# EAGLE design Board Layout (EAGLE 6.1)
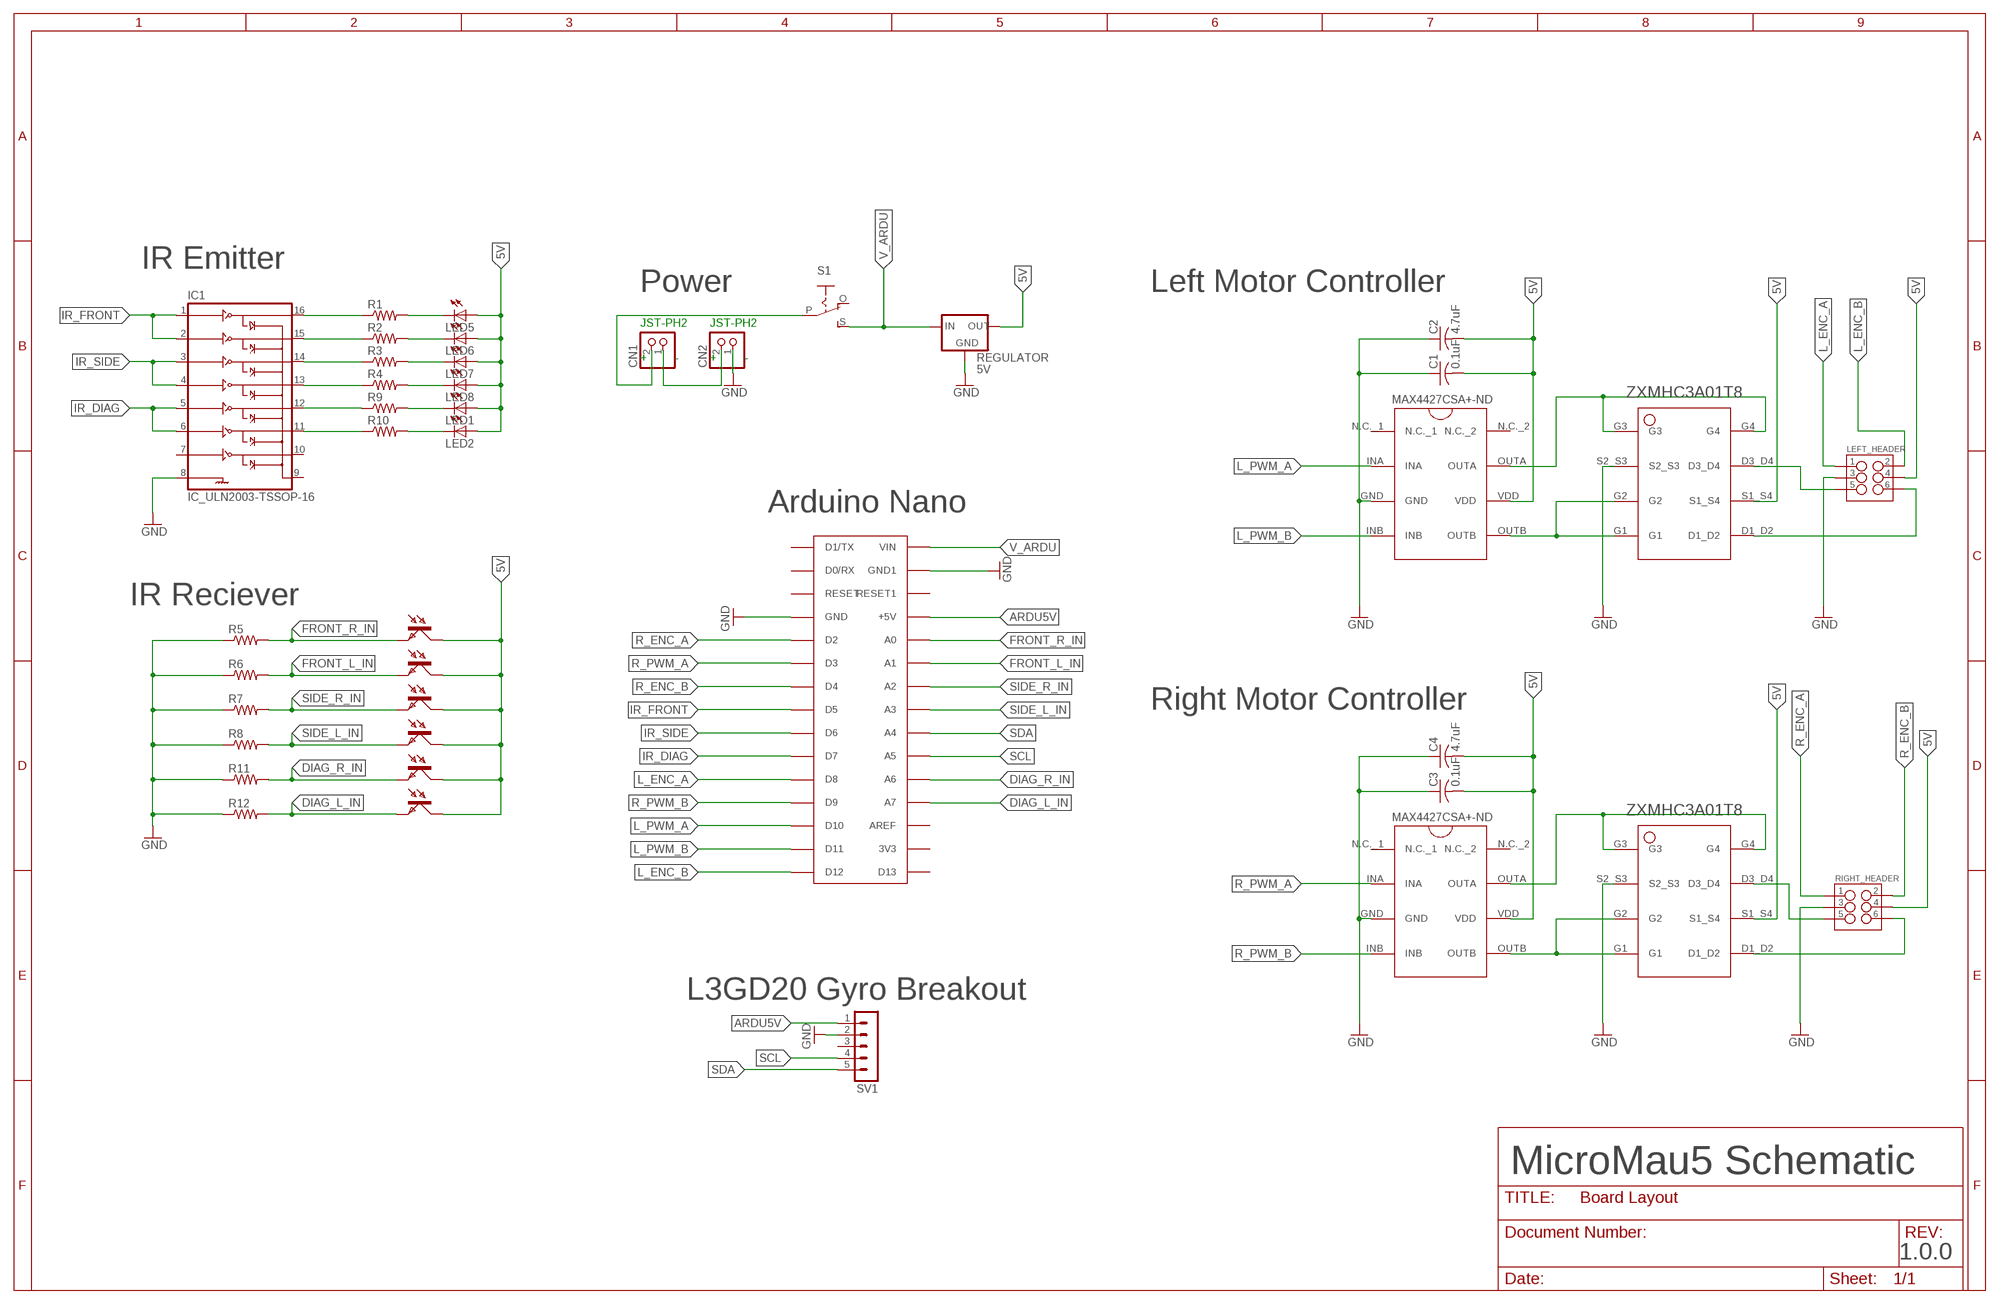
[diagram p0: schematic, sheet 1]

## Parts
C1  0.1uF  C-USC0805  [C0805]
C2  4.7uF  C-USC0805  [C0805]
C3  0.1uF  C-USC0805  [C0805]
C4  4.7uF  C-USC0805  [C0805]
CN1  JST_2PIN-THM  [JST-PH-2-THM]
CN2  JST_2PIN-THM  [JST-PH-2-THM]
IC1  IC_ULN2003-TSSOP-16  [TSSOP-16]
LED1  LED5MM  [LED5MM]
LED2  LED5MM  [LED5MM]
LED5  LED5MM  [LED5MM]
LED6  LED5MM  [LED5MM]
LED7  LED5MM  [LED5MM]
LED8  LED5MM  [LED5MM]
LEFT_HEADER  M03X2SHROUD  [2X3-SHROUDED]
R1  R-US_M0805  [M0805]
R2  R-US_M0805  [M0805]
R3  R-US_M0805  [M0805]
R4  R-US_M0805  [M0805]
R5  R-US_R0805  [R0805]
R6  R-US_R0805  [R0805]
R7  R-US_R0805  [R0805]
R8  R-US_R0805  [R0805]
R9  R-US_M0805  [M0805]
R10  R-US_M0805  [M0805]
R11  R-US_R0805  [R0805]
R12  R-US_R0805  [R0805]
REGULATOR  5V  MCP1700INLINE  [TO92-INLINE]
RIGHT_HEADER  M03X2SHROUD  [2X3-SHROUDED]
S1  EG1218S  [EG1218]
SV1  MA05-1  [MA05-1]
T1  BPX81  [BPX81]
T2  BPX81  [BPX81]
T3  BPX81  [BPX81]
T4  BPX81  [BPX81]
T5  BPX81  [BPX81]
T6  BPX81  [BPX81]
U$1  MAX4427CSA+-ND  [MAX4427CSA+-ND]
U$2  ZXMHC3A01T8  [ZXMHC3A01T8]
U$3  ARDUINONANO  [PDIP-32]
U$4  MAX4427CSA+-ND  [MAX4427CSA+-ND]
U$5  ZXMHC3A01T8  [ZXMHC3A01T8]

## Nets
5V [PWR]: C1.2 C2.2 C3.2 C4.2 LED1.A LED2.A LED5.A LED6.A LED7.A LED8.A LEFT_HEADER.4 REGULATOR.3(OUT) RIGHT_HEADER.4 T1.C T2.C T3.C T4.C T5.C T6.C U$1.VDD U$2.S1_S4 U$4.VDD U$5.S1_S4
ARDU5V: SV1.1 U$3.+5V
DIAG_L_IN: R12.2 T6.E U$3.A7
DIAG_R_IN: R11.2 T5.E U$3.A6
FRONT_L_IN: R6.2 T3.E U$3.A1
FRONT_R_IN: R5.2 T2.E U$3.A0
GND [PWR]: C1.1 C2.1 C3.1 C4.1 CN2.1 IC1.8(GND) LEFT_HEADER.3 R5.1 R6.1 R7.1 R8.1 R11.1 R12.1 REGULATOR.1(GND) RIGHT_HEADER.3 SV1.2 U$1.GND U$2.S2_S3 U$3.GND U$3.GND1 U$4.GND U$5.S2_S3
IR_DIAG: IC1.5(5B) IC1.6(6B) U$3.D7
IR_FRONT: IC1.1(1B) IC1.2(2B) U$3.D5
IR_SIDE: IC1.3(3B) IC1.4(4B) U$3.D6
L_ENC_A: LEFT_HEADER.1 U$3.D8
L_ENC_B: LEFT_HEADER.2 U$3.D12
L_PWM_A: U$1.INA U$3.D10
L_PWM_B: U$1.INB U$3.D11
N$1: U$1.OUTB U$2.G1 U$2.G2
N$2: LEFT_HEADER.5 U$2.D3_D4
N$3: U$1.OUTA U$2.G3 U$2.G4
N$4: LEFT_HEADER.6 U$2.D1_D2
N$5 [PWR]: CN1.1 CN2.2
N$6 [PWR]: CN1.2 S1.P
N$7: U$4.OUTB U$5.G1 U$5.G2
N$8: U$4.OUTA U$5.G3 U$5.G4
N$9: RIGHT_HEADER.5 U$5.D3_D4
N$10: RIGHT_HEADER.6 U$5.D1_D2
N$11: IC1.16(1C) R1.1
N$12: IC1.15(2C) R2.1
N$13: IC1.14(3C) R3.1
N$14: IC1.13(4C) R4.1
N$15: LED5.K(C) R1.2
N$16: LED6.K(C) R2.2
N$17: LED7.K(C) R3.2
N$18: LED8.K(C) R4.2
N$19: IC1.12(5C) R9.1
N$20: IC1.11(6C) R10.1
N$21: LED1.K(C) R9.2
N$22: LED2.K(C) R10.2
R_ENC_A: RIGHT_HEADER.1 U$3.D2
R_ENC_B: RIGHT_HEADER.2 U$3.D4
R_PWM_A: U$3.D3 U$4.INA
R_PWM_B: U$3.D9 U$4.INB
SCL: SV1.4 U$3.A5
SDA: SV1.5 U$3.A4
SIDE_L_IN: R8.2 T4.E U$3.A3
SIDE_R_IN: R7.2 T1.E U$3.A2
V_ARDU [PWR]: REGULATOR.2(IN) S1.S U$3.VIN
Unconnected: IC1.7(7B) IC1.9(COM) IC1.10(7C) S1.O SV1.3 U$1.N.C._1 U$1.N.C._2 U$3.3V3 U$3.AREF U$3.D0/RX U$3.D1/TX U$3.D13 U$3.RESET U$3.RESET1 U$4.N.C._1 U$4.N.C._2

## Notes on the sheet
- IR Emitter
- Power | Left Motor Controller
- JST-PH2 | JST-PH2
- + | - | + | -
- Arduino Nano
- IR Reciever
- Right Motor Controller
- L3GD20 Gyro Breakout
- MicroMau5 Schematic
- 1.0.0

## Library data of the parts
C1-C4 = adafruit:C-US: CAPACITOR, American symbol
CN1 CN2 = adafruit:JST_2PIN: JST 2-Pin Connectors of various flavors SMT-RA (S2B-PH-SM4) 4UConnector #17311 SMT (B2B-PH-SM4) THM-RA (S2B-PH) THM (B2B-PH)
IC1 = dp_devices:IC_ULN2003: 7 Darlington Array Driver
LED1 LED2 LED5-LED8 = adafruit:LED: LED OSRAM: - CHIPLED LG R971, LG N971, LY N971, LG Q971, LY Q971, LO R971, LY R971 LH N974, LH R974 LS Q976, LO Q976, LY Q976 LO Q996 - Hyper CHIPLED LW Q18S LB Q993, LB Q99A, LB R99A - SideLED LS A670, LO A670, LY A670, LG A670, LP A670 LB A673, LV A673, LT A673, LW A673 LH A674 LY A675 LS A676, LA A676, LO A676, LY A676, LW A676 LS A679, LY A679, LG A679 - Hyper Micro SIDELED® LS Y876, LA Y876, LO Y876, LY Y876 LT Y87S - SmartLED LW L88C, LW L88S LB L89C, LB L89S, LG L890 LS L89K, LO L89K, LY L89K LS L896, LA L896, LO L896, LY L896 - TOPLED LS T670, LO T670, LY T670, LG T670, LP T670 LSG T670, LSP T670, LSY T670, LOP T670, LYG T670 LG T671, LOG T671, LSG T671 LB T673, LV T673, LT T673, LW T673 LH T674 LS T676, LA T676, LO T676, LY T676, LB T676, LH T676, LSB T676, LW T676 LB T67C, LV T67C, LT T67C, LS T67K, LO T67K, LY T67K, LW E67C LS E67B, LA E67B, LO E67B, LY E67B, LB E67C, LV E67C, LT E67C LW T67C LS T679, LY T679, LG T679 LS T770, LO T770, LY T770, LG T770, LP T770 LB T773, LV T773, LT T773, LW T773 LH T774 LS E675, LA E675, LY E675, LS T675 LS T776, LA T776, LO T776, LY T776, LB T776 LHGB T686 LT T68C, LB T68C - Hyper Mini TOPLED® LB M676 - Mini TOPLED Santana® LG M470 LS M47K, LO M47K, LY M47K Source: http://www.osram.convergy.de/
LEFT_HEADER RIGHT_HEADER = SparkFun-Connectors:M03X2: 2x3 .1" header. Shrouded, with keying- CONN-10681 SMT- CONN-11415 Pogo pins- HW-11044; PROD_ID: CONN-10681
R1-R12 = adafruit:R-US_: RESISTOR, American symbol
REGULATOR = adafruit:MCP1700: VOLTAGE REGULATOR
S1 = adafruit:EG1218: SLIDING SWITCH 0.1" spacing through hole, vertical SPDT slide switch http://www.ladyada.net/library/pcb/eaglelibrary.html
SV1 = con-lstb:MA05-1: PIN HEADER; OC_FARNELL: unknown; OC_NEWARK: unknown
T1-T6 = opto-trans-siemens:BPX81: PHOTO TRANSISTOR; OC_FARNELL: unknown; OC_NEWARK: unknown
U$1 U$4 = MAX4427CSA+-ND:MAX4427CSA+-ND
U$2 U$5 = ZXMHC3A01T8:ZXMHC3A01T8
U$3 = jet-lib:ARDUINONANO

## Net classes
0 default: width 0.254 mm, drill 0.508 mm, clearance 0.203 mm
1 PWR: width 0.508 mm, drill 0.508 mm, clearance 0.203 mm

## Board
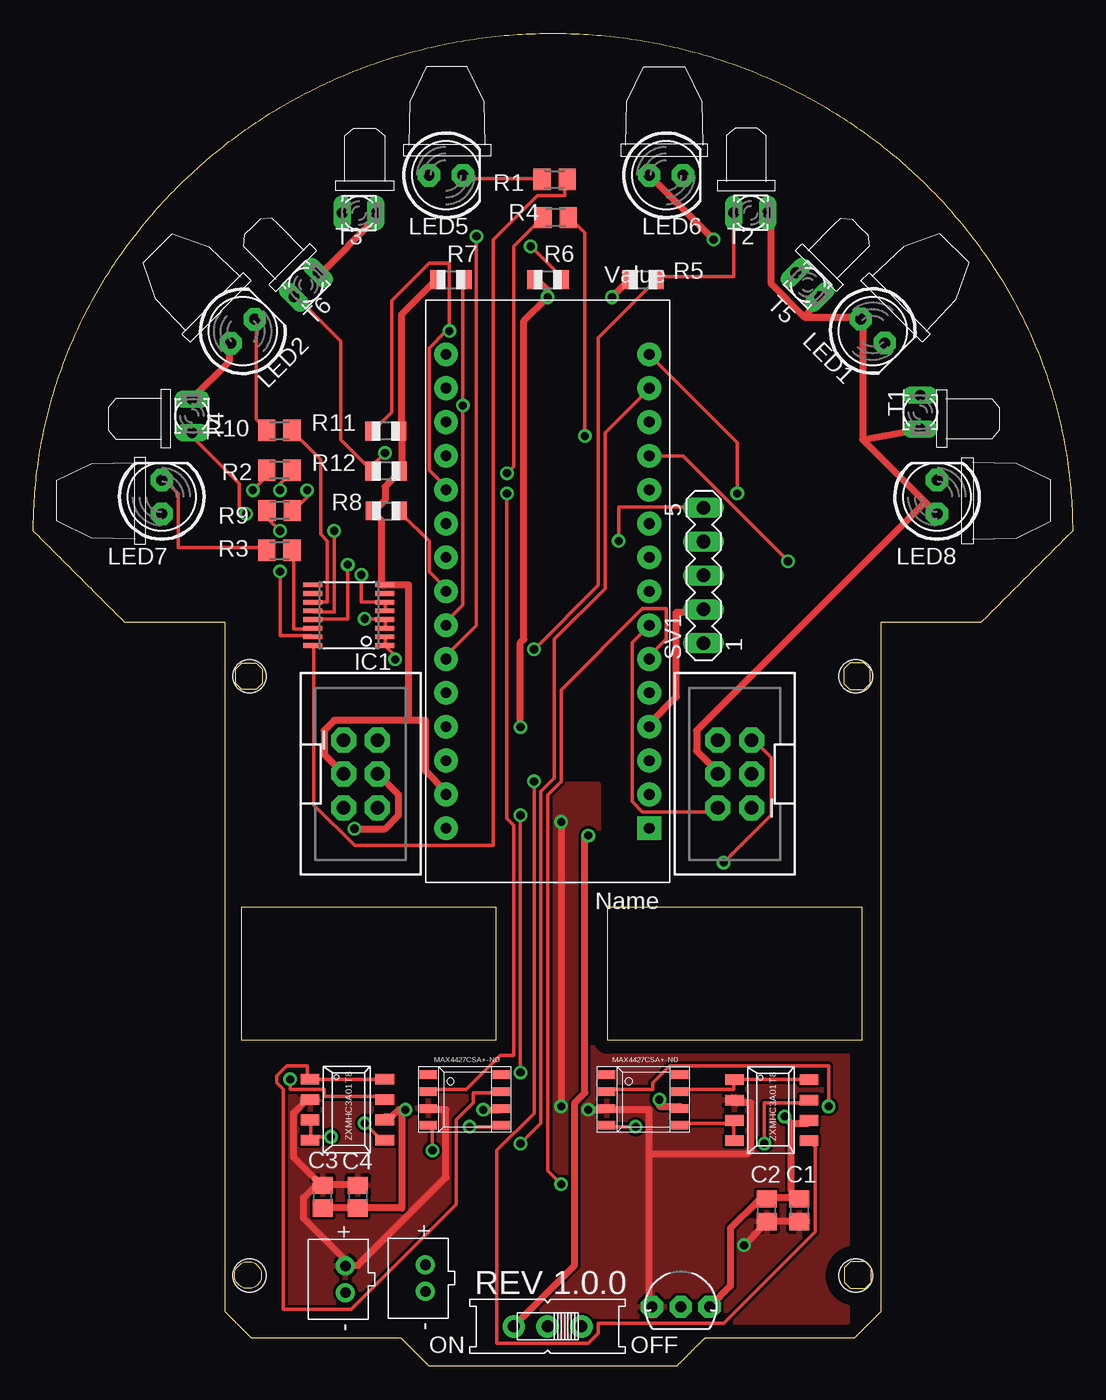
[diagram p1: board, top side]
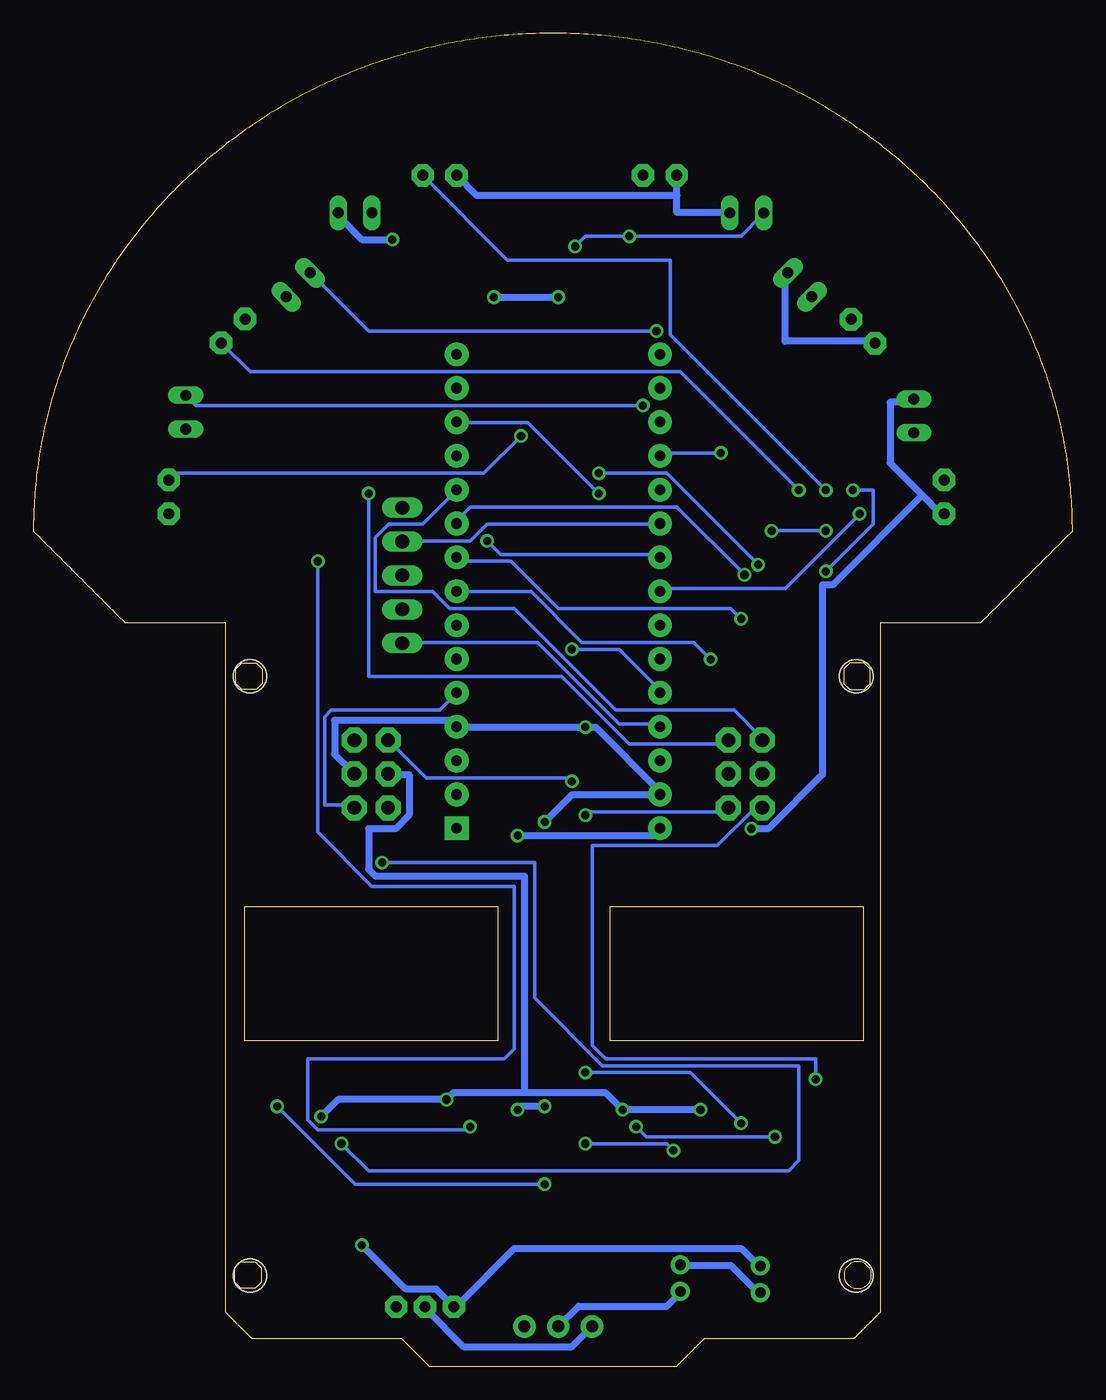
[diagram p2: board, bottom side, seen from below]

Size 77.93 x 99.99 mm. Coordinates in mm from the lower left corner, seen from the top.
Outline: 38.99,99.99 38.65,99.99 38.31,99.99 37.98,99.98 37.65,99.97 37.31,99.96 36.98,99.94 36.65,99.93 36.32,99.91 35.99,99.88 35.66,99.86 35.33,99.83 35,99.8 34.67,99.77 34.35,99.73 34.02,99.69 33.7,99.65 33.37,99.61 33.05,99.56 32.73,99.51 32.41,99.46 32.08,99.41 31.76,99.35 31.45,99.3 31.13,99.23 30.81,99.17 30.5,99.11 30.18,99.04 29.87,98.97 29.55,98.89 29.24,98.82 28.93,98.74 28.62,98.66 28.31,98.58 28,98.49 27.7,98.4 27.39,98.31 27.09,98.22 26.78,98.13 26.18,97.93 25.88,97.83 25.58,97.73 25.28,97.62 24.99,97.51 24.69,97.4 24.4,97.29 24.1,97.18 23.81,97.06 23.52,96.94 23.23,96.82 22.94,96.69 22.65,96.57 22.37,96.44 22.08,96.31 21.8,96.18 21.52,96.04 21.24,95.91 20.96,95.77 20.68,95.63 20.4,95.49 20.13,95.34 19.85,95.19 19.31,94.9 19.04,94.74 18.77,94.59 18.5,94.43 18.24,94.27 17.97,94.11 17.71,93.95 17.45,93.78 17.19,93.62 16.93,93.45 16.67,93.28 16.42,93.1 16.16,92.93 15.91,92.75 15.66,92.57 15.41,92.4 15.16,92.21 14.92,92.03 14.67,91.84 14.43,91.66 14.19,91.47 13.95,91.28 13.71,91.08 13.47,90.89 13.24,90.69 13,90.49 12.77,90.29 12.54,90.09 12.31,89.89 12.09,89.68 11.86,89.48 11.64,89.27 11.42,89.06 11.2,88.84 10.98,88.63 10.77,88.42 10.55,88.2 10.34,87.98 9.92,87.54 9.71,87.32 9.51,87.09 9.3,86.86 9.1,86.64 8.9,86.4 8.7,86.17 8.51,85.94 8.32,85.71 8.12,85.47 7.93,85.23 7.56,84.75 7.37,84.51 7.19,84.27 7.01,84.02 6.83,83.78 6.66,83.53 6.48,83.28 6.31,83.03 6.14,82.78 5.97,82.53 5.81,82.27 5.64,82.02 5.48,81.76 5.32,81.5 5.17,81.24 5.01,80.98 4.86,80.72 4.71,80.45 4.56,80.19 4.41,79.92 4.27,79.65 4.12,79.38 3.98,79.11 3.84,78.84 3.71,78.57 3.57,78.3 3.44,78.02 3.31,77.75 3.19,77.47 3.06,77.19 2.94,76.91 2.82,76.63 2.7,76.35 2.59,76.06 2.48,75.78 2.37,75.49 2.26,75.21 2.15,74.92 2.05,74.63 1.95,74.34 1.85,74.05 1.75,73.76 1.66,73.47 1.57,73.17 1.48,72.88 1.39,72.58 1.31,72.28 1.23,71.99 1.15,71.69 1.07,71.39 1,71.09 0.93,70.79 0.86,70.48 0.79,70.18 0.73,69.88 0.67,69.57 0.61,69.26 0.55,68.96 0.5,68.65 0.45,68.34 0.4,68.03 0.35,67.72 0.31,67.41 0.27,67.1 0.23,66.79 0.2,66.47 0.17,66.16 0.14,65.84 0.11,65.53 0.09,65.21 0.07,64.89 0.05,64.58 0.03,64.26 0.02,63.94 0.01,63.62 0,63.3 0,62.98 0,62.65 0.11,62.55 0.22,62.44 0.32,62.33 0.43,62.23 0.54,62.12 0.75,61.9 0.86,61.8 0.97,61.69 1.07,61.58 1.18,61.47 1.29,61.37 1.4,61.26 1.5,61.15 1.61,61.04 1.72,60.94 1.83,60.83 1.93,60.72 2.04,60.62 2.15,60.51 2.25,60.4 2.36,60.29 2.47,60.19 2.68,59.97 2.79,59.86 2.9,59.76 3.01,59.65 3.11,59.54 3.22,59.43 3.33,59.33 3.54,59.11 3.65,59 3.76,58.9 3.97,58.68 4.08,58.58 4.19,58.47 4.29,58.36 4.4,58.25 4.51,58.15 4.62,58.04 4.72,57.93 4.83,57.82 4.94,57.72 5.05,57.61 5.26,57.39 5.37,57.29 5.48,57.18 5.69,56.97 5.8,56.86 5.9,56.75 6.01,56.64 6.12,56.54 6.23,56.43 6.33,56.32 6.66,56 6.76,55.89 6.87,55.78 14.39,55.78 14.39,4.08 14.42,4.05 14.45,4.02 14.51,3.95 14.54,3.92 14.58,3.89 14.61,3.86 14.67,3.8 14.7,3.77 14.73,3.73 14.79,3.67 14.83,3.64 14.86,3.61 14.89,3.58 14.92,3.55 14.95,3.52 15.04,3.42 15.07,3.39 15.11,3.36 15.17,3.3 15.2,3.27 15.23,3.24 15.32,3.14 15.35,3.11 15.42,3.05 15.45,3.02 15.54,2.93 15.57,2.89 15.6,2.86 15.67,2.8 15.7,2.77 15.73,2.74 15.76,2.71 15.79,2.68 15.82,2.65 15.85,2.61 15.88,2.58 15.91,2.55 15.95,2.52 15.98,2.49 16.01,2.46 16.07,2.4 16.1,2.37 16.13,2.33 16.16,2.3 16.19,2.27 16.29,2.18 16.32,2.15 16.35,2.12 16.38,2.09 27.6,2.09 27.63,2.05 27.67,2.02 27.7,1.99 27.73,1.96 27.76,1.92 27.8,1.89 27.83,1.86 27.86,1.82 27.89,1.79 27.93,1.76 27.96,1.73 27.99,1.69 28.02,1.66 28.06,1.63 28.09,1.6 28.15,1.53 28.19,1.5 28.22,1.47 28.28,1.4 28.32,1.37 28.35,1.34 28.38,1.3 28.42,1.27 28.45,1.24 28.48,1.21 28.51,1.17 28.58,1.11 28.61,1.08 28.64,1.04 28.68,1.01 28.71,0.98 28.74,0.94 28.77,0.91 28.81,0.88 28.87,0.81 28.9,0.78 28.94,0.75 28.97,0.72 29,0.68 29.07,0.62 29.1,0.59 29.13,0.55 29.16,0.52 29.2,0.49 29.23,0.46 29.26,0.42 29.29,0.39 29.33,0.36 29.36,0.33 29.39,0.29 29.43,0.26 29.46,0.23 29.49,0.2 29.52,0.16 29.56,0.13 29.59,0.1 29.62,0.07 29.65,0.03 29.69,0 48.25,0 48.28,0.03 48.31,0.07 48.34,0.1 48.38,0.13 48.41,0.16 48.44,0.2 48.47,0.23 48.51,0.26 48.54,0.29 48.61,0.36 48.67,0.42 48.7,0.46 48.74,0.49 48.8,0.55 48.83,0.59 48.87,0.62 48.93,0.68 49,0.75 49.06,0.81 49.09,0.85 49.13,0.88 49.16,0.91 49.19,0.94 49.22,0.98 49.26,1.01 49.32,1.08 49.35,1.11 49.39,1.14 49.42,1.17 49.45,1.21 49.49,1.24 49.52,1.27 49.58,1.34 49.65,1.4 49.71,1.47 49.75,1.5 49.78,1.53 49.84,1.6 49.88,1.63 49.91,1.66 49.94,1.69 50.01,1.76 50.04,1.79 50.1,1.86 50.14,1.89 50.17,1.92 50.2,1.96 50.23,1.99 50.27,2.02 50.3,2.05 50.33,2.09 61.55,2.09 61.58,2.12 61.61,2.15 61.64,2.18 61.74,2.27 61.77,2.3 61.83,2.37 61.86,2.4 61.96,2.49 61.99,2.52 62.02,2.55 62.05,2.58 62.08,2.61 62.11,2.65 62.14,2.68 62.17,2.71 62.2,2.74 62.24,2.77 62.27,2.8 62.33,2.86 62.36,2.89 62.39,2.93 62.42,2.96 62.49,3.02 62.52,3.05 62.55,3.08 62.58,3.11 62.61,3.14 62.7,3.24 62.73,3.27 62.77,3.3 62.83,3.36 62.86,3.39 62.89,3.42 62.98,3.52 63.01,3.55 63.05,3.58 63.08,3.61 63.11,3.64 63.14,3.67 63.2,3.73 63.23,3.77 63.26,3.8 63.33,3.86 63.36,3.89 63.39,3.92 63.42,3.95 63.48,4.02 63.51,4.05 63.54,4.08 63.54,55.78 71.06,55.78 71.17,55.89 71.28,56 71.38,56.11 71.49,56.21 71.6,56.32 71.71,56.43 71.81,56.54 72.03,56.75 72.14,56.86 72.24,56.97 72.35,57.07 72.46,57.18 72.56,57.29 72.67,57.39 72.78,57.5 72.89,57.61 72.99,57.72 73.1,57.82 73.21,57.93 73.32,58.04 73.42,58.15 73.53,58.25 73.64,58.36 73.75,58.47 73.96,58.68 74.07,58.79 74.17,58.9 74.28,59 74.39,59.11 74.5,59.22 74.6,59.33 74.71,59.43 74.82,59.54 74.93,59.65 75.03,59.76 75.14,59.86 75.25,59.97 75.36,60.08 75.46,60.19 75.57,60.29 75.68,60.4 75.89,60.62 76,60.72 76.11,60.83 76.32,61.04 76.43,61.15 76.54,61.26 76.64,61.37 76.75,61.47 76.86,61.58 76.97,61.69 77.07,61.8 77.18,61.9 77.29,62.01 77.4,62.12 77.5,62.23 77.61,62.33 77.72,62.44 77.83,62.55 77.93,62.65 77.93,62.98 77.93,63.3 77.92,63.62 77.91,63.94 77.9,64.26 77.88,64.58 77.86,64.89 77.84,65.21 77.82,65.53 77.79,65.84 77.76,66.16 77.73,66.47 77.7,66.79 77.66,67.1 77.62,67.41 77.58,67.72 77.53,68.03 77.48,68.34 77.43,68.65 77.38,68.96 77.32,69.26 77.27,69.57 77.21,69.88 77.14,70.18 77.08,70.48 77.01,70.79 76.93,71.09 76.86,71.39 76.79,71.69 76.71,71.99 76.63,72.28 76.54,72.58 76.45,72.88 76.37,73.17 76.27,73.47 76.18,73.76 76.08,74.05 75.99,74.34 75.88,74.63 75.78,74.92 75.68,75.21 75.46,75.78 75.34,76.06 75.23,76.35 75.11,76.63 74.99,76.91 74.75,77.47 74.62,77.75 74.49,78.02 74.36,78.3 74.23,78.57 74.09,78.84 73.95,79.11 73.81,79.38 73.67,79.65 73.52,79.92 73.38,80.19 73.23,80.45 73.08,80.72 72.92,80.98 72.77,81.24 72.61,81.5 72.45,81.76 72.13,82.27 71.96,82.53 71.79,82.78 71.62,83.03 71.45,83.28 71.27,83.53 71.1,83.78 70.92,84.02 70.56,84.51 70.37,84.75 70.19,84.99 70,85.23 69.81,85.47 69.62,85.71 69.42,85.94 69.23,86.17 69.03,86.4 68.83,86.64 68.63,86.86 68.43,87.09 68.22,87.32 68.01,87.54 67.8,87.76 67.6,87.98 67.38,88.2 67.17,88.42 66.95,88.63 66.73,88.84 66.51,89.06 66.29,89.27 66.07,89.48 65.84,89.68 65.62,89.89 65.39,90.09 65.16,90.29 64.93,90.49 64.7,90.69 64.46,90.89 64.22,91.08 63.99,91.28 63.75,91.47 63.5,91.66 63.26,91.84 63.02,92.03 62.77,92.21 62.52,92.4 62.27,92.57 62.02,92.75 61.77,92.93 61.52,93.1 61.26,93.28 61,93.45 60.74,93.62 60.48,93.78 60.22,93.95 59.96,94.11 59.7,94.27 59.43,94.43 59.16,94.59 58.89,94.74 58.62,94.9 58.08,95.19 57.81,95.34 57.53,95.49 57.25,95.63 56.98,95.77 56.7,95.91 56.41,96.04 56.13,96.18 55.85,96.31 55.56,96.44 55.28,96.57 54.99,96.69 54.7,96.82 54.41,96.94 54.12,97.06 53.83,97.18 53.54,97.29 53.24,97.4 52.95,97.51 52.65,97.62 52.05,97.83 51.75,97.93 51.15,98.13 50.84,98.22 50.54,98.31 50.23,98.4 49.93,98.49 49.62,98.58 49.31,98.66 49,98.74 48.38,98.89 48.07,98.97 47.75,99.04 47.44,99.11 47.12,99.17 46.8,99.23 46.49,99.3 46.17,99.35 45.85,99.41 45.53,99.46 45.21,99.51 44.88,99.56 44.56,99.61 44.24,99.65 43.91,99.69 43.59,99.73 43.26,99.77 42.93,99.8 42.6,99.83 42.28,99.86 41.95,99.88 41.62,99.91 41.29,99.93 40.95,99.94 40.62,99.96 40.29,99.97 39.95,99.98 39.62,99.99 39.28,99.99 38.95,99.99
Outline: 62.12,24.44 43.07,24.44 43.07,34.44 62.12,34.44 62.12,24.44
Outline: 34.69,24.44 15.64,24.44 15.64,34.44 34.69,34.44 34.69,24.44
Outline: 17.16,51.21 16.72,50.76 15.61,50.76 15.16,51.21 15.16,52.31 15.61,52.76 16.72,52.76 17.16,52.31 17.16,51.21
Outline: 17.11,7.1 17.11,6.55 16.99,6.3 16.81,6.12 16.63,5.94 16.38,5.83 15.83,5.83 15.58,5.94 15.4,6.12 15.22,6.3 15.11,6.55 15.11,7.1 15.22,7.35 15.4,7.53 15.58,7.72 15.83,7.83 16.38,7.83 16.63,7.72 16.81,7.53 16.99,7.35 17.11,7.1
Outline: 60.77,51.21 61.22,50.76 62.32,50.76 62.77,51.21 62.77,52.31 62.32,52.76 61.22,52.76 60.77,52.31 60.77,51.21
Outline: 60.83,7.38 60.83,6.27 61.27,5.83 62.38,5.83 62.83,6.27 62.83,7.38 62.38,7.83 61.27,7.83 60.83,7.38
Copper layers (1*16): Top 0.035mm / dielectric 1.5mm / Bottom 0.035mm
Design rules: minimum track width 10mil, minimum drill 24mil, track to track 8mil, track to pad 8mil, pad to pad 8mil, via to via 8mil, smd to smd 8mil, copper to edge 40mil, drill to drill 8mil, minimum pad ring 10mil, minimum via ring 8mil, stop-mask expansion 4mil, vias tented up to drill 0mil, thermal gap 10mil
Holes 2.5 mm at 16.21,6.79 16.21,51.75 61.68,51.75 61.68,6.79

### Footprints (pad centres in the part's own frame; a part is rotated, then mirrored left to right if it is on the bottom)
C0805 = smd 1.3 x 1.5: 1 -0.85,0; 2 0.85,0
JST-PH-2-THM = drill 0.8 pad 1.422: 1 1,0; 2 -1,0
TSSOP-16 = smd 0.35 x 1.43: 1 -2.275,-2.7; 2 -1.625,-2.7; 3 -0.975,-2.7; 4 -0.325,-2.7; 5 0.325,-2.7; 6 0.975,-2.7; 7 1.625,-2.7; 8 2.275,-2.7; 9 2.275,2.7; 10 1.625,2.7; 11 0.975,2.7; 12 0.325,2.7; 13 -0.325,2.7; 14 -0.975,2.7; 15 -1.625,2.7; 16 -2.275,2.7
LED5MM = drill 0.813 pad 1.676 octagon: A -1.27,0; K 1.27,0
2X3-SHROUDED = drill 1.016 pad 1.88 octagon: 1 -1.27,2.54; 2 1.27,2.54; 3 -1.27,0; 4 1.27,0; 5 -1.27,-2.54; 6 1.27,-2.54
M0805 = smd 1.3 x 1.6: 1 -0.95,0; 2 0.95,0
R0805 = smd 1.1 x 1.4: 1 -1,0; 2 1,0
TO92-INLINE = drill 0.813 pad 1.676 octagon: 1 -2.159,0; 2 0,0; 3 2.159,0
EG1218 = drill 0.9 pad 1.676: O -2.54,0; P 0,0; S 2.54,0
MA05-1 = drill 1.016 long: 1 -5.08,0; 2 -2.54,0; 3 0,0; 4 2.54,0; 5 5.08,0
BPX81 = drill 0.813 long: C 1.27,0; E -1.27,0
MAX4427CSA+-ND = smd 1.27 x 0.635: GND -2.946,-0.762; INA -2.946,0.508; INB -2.946,-2.032; N.C._1 -2.946,1.778; N.C._2 2.54,1.778; OUTA 2.54,0.508; OUTB 2.54,-2.032; VDD 2.54,-0.762
ZXMHC3A01T8 = smd 1.4 x 0.8: D1_D2 2.695,-2.22; D3_D4 2.695,0.84; G1 -2.905,-2.22; G2 -2.905,-0.69; G3 -2.905,2.37; G4 2.695,2.37; S1_S4 2.695,-0.69; S2_S3 -2.905,0.84
PDIP-32 = drill 0.8 pad 1.778: 3V3 15.24,-35.56; +5V 15.24,-10.16; A0 15.24,-12.7; A1 15.24,-15.24; A2 15.24,-17.78; A3 15.24,-20.32; A4 15.24,-22.86; A5 15.24,-25.4; A6 15.24,-27.94; A7 15.24,-30.48; AREF 15.24,-33.02; D0/RX 0,-5.08; D2 0,-12.7; D3 0,-15.24; D4 0,-17.78; D5 0,-20.32; D6 0,-22.86; D7 0,-25.4; D8 0,-27.94; D9 0,-30.48; D10 0,-33.02; D11 0,-35.56; D12 0,-38.1; D13 15.24,-38.1; GND 0,-10.16; GND1 15.24,-5.08; RESET 0,-7.62; RESET1 15.24,-7.62; VIN 15.24,-2.54 | drill 0.8 pad 1.778 square: D1/TX 0,-2.54

### Placement (x,y rotation side)
C1  57.45,11.7 90 top
C2  55,11.7 90 top
C3  21.69,12.72 270 top
C4  24.34,12.72 270 top
CN1  29.41,6.6 90 top
CN2  23.41,6.52 90 top
IC1  23.66,56.34 90 top
LED1  62.95,77.66 315 top
LED2  15.71,77.64 45 top
LED5  30.95,89.34 0 top
LED6  47.46,89.34 0 top
LED7  9.63,65.21 90 top
LED8  67.78,65.21 90 top
LEFT_HEADER  24.54,44.43 0 top
R1  39.09,89.03 180 top
R2  18.45,67.2 0 top
R3  18.45,61.2 180 top
R4  39.17,86.16 0 top
R5  45.73,81.52 0 top
R6  38.59,81.52 0 top
R7  31.32,81.52 0 top
R8  26.47,64.16 0 top
R9  18.46,64.19 0 top
R10  18.45,70.2 180 top
R11  26.42,70.16 180 top
R12  26.45,67.15 180 top
REGULATOR  48.56,4.45 0 top
RIGHT_HEADER  52.6,44.43 180 top
S1  38.57,2.98 180 top
SV1  50.27,59.32 90 top
T1  66.51,71.56 270 top
T2  53.81,86.53 0 top
T3  24.43,86.51 0 top
T4  11.9,71.29 90 top
T5  58.07,81.13 315 top
T6  20.45,81.13 45 top
U$1  32.56,20.1 0 top
U$2  23.66,19.17 0 top
U$3  46.19,37.81 180 top
U$4  45.94,20.1 0 top
U$5  55.48,19.13 0 top

### Tracks (layer width: path | path; a pad name or v marks a point on that pad's centre or on a via)
5V  (via drill 0.61)
  Top 0.508: T6.C 21.55,81.98 25.61,86.04 25.61,86.29 T3.C | T4.C 11.9,72.58 14.69,75.37 14.69,76.64 LED2.A | v24.09,40.32 26.37,40.32 27.39,41.34 27.39,42.86 25.87,44.38 LEFT_HEADER.4 | 56.85,18.22 58.12,18.22 U$5.S1_S4 | 56.85,18.22 56.85,13.14 57.36,12.63 C1.2 56.85,12.89 56.85,12.63 55.08,12.63 C2.2 54.82,12.38 54.31,12.38 52.28,10.35 52.28,6.03 50.76,4.51 REGULATOR.3 | C3.2 C4.2 27.64,11.87 27.64,19.24 | v33.74,19.24 35.01,19.24 U$1.VDD | 27.64,19.24 27.39,19.24 26.88,18.73 26.37,18.73 U$2.S1_S4 | v46.95,20 46.95,19.49 48.47,19.49 U$4.VDD | 27.64,19.24 v27.9,19.24 | v56.35,18.73 56.85,18.22 | 57.87,78.67 55.33,81.21 55.33,86.04 55.08,86.29 T2.C | 57.87,78.67 61.93,78.67 LED1.A 62.19,78.42 62.19,69.53 | 62.19,69.53 66.89,64.83 | 66.89,64.83 LED8.A | 66.89,64.83 49.74,47.69 49.74,46.16 51.27,44.64 RIGHT_HEADER.4 | v51.01,84.52 LED6.A | 57.87,78.67 T5.C | 62.19,69.53 T1.C
  Bottom 0.508: 29.68,87.82 29.68,86.55 25.87,86.55 T3.C | 29.68,87.82 LED5.A | LED6.A 44.66,87.82 29.68,87.82 | 11.26,65.34 13.67,67.75 13.67,72.32 11.9,72.32 T4.C | 11.26,65.34 9.86,63.94 LED7.A | v24.09,40.32 22.82,40.32 18.75,44.38 18.75,58.61 17.99,58.61 11.26,65.34 | T6.C 21.55,81.98 21.55,76.9 14.94,76.9 LED2.A | v27.9,19.24 v33.74,19.24 35.01,20.51 41.11,20.51 | 41.11,20.51 46.44,20.51 v46.95,20 55.08,20 v56.35,18.73 | 41.11,20.51 41.11,36.76 52.28,36.76 52.79,37.27 52.79,40.32 50.76,40.32 49.74,41.34 49.74,44.38 51.27,44.38 RIGHT_HEADER.4 | v51.01,84.52 53.3,84.52 55.08,86.29 T2.C
ARDU5V
  Bottom 0.254: SV1.1 50.25,54.29 40.09,54.29 33.99,48.19 30.95,48.19 U$3.+5V
DIAG_L_IN  (via drill 0.61)
  Top 0.254: T6.E 19.77,80.2 23.07,76.9 23.07,69.53 25.36,67.24 R12.2 25.61,67.24 25.61,67.75 v26.37,68.51
  Bottom 0.254: v26.37,68.51 30.95,68.51 U$3.A7
DIAG_R_IN  (via drill 0.61)
  Top 0.254: 30.95,77.66 29.68,76.39 29.68,67.24 30.95,65.97 U$3.A6 | 30.95,77.66 31.2,77.91 31.2,82.74 29.68,82.74 26.88,79.94 26.88,71.56 25.61,70.29 R11.2 | 30.95,77.66 v31.2,77.66
  Bottom 0.254: v31.2,77.66 52.79,77.66 57.11,81.98 T5.E
FRONT_L_IN  (via drill 0.61)
  Top 0.254: v37.3,84.01 39.58,81.72 R6.2 | v33.23,84.77 33.23,55.56 30.95,53.27 U$3.A1
  Bottom 0.254: v37.3,84.01 36.53,84.77 v33.23,84.77 24.85,84.77 23.33,86.29 T3.E
FRONT_R_IN  (via drill 0.61)
  Top 0.254: T2.E 52.54,81.72 46.95,81.72 R5.2 46.69,81.47 42.38,77.15 42.38,58.61 v37.55,53.78
  Bottom 0.254: v37.55,53.78 33.99,53.78 30.95,50.73 U$3.A0
GND  (via drill 0.61)
  Top 0.508: U$2.S2_S3 20.53,20 19.52,18.98 19.52,15.68 21.55,13.65 C3.1 | C4.1 24.09,13.65 21.8,13.65 C3.1 | U$1.GND 29.68,19.24 30.95,19.24 30.95,14.16 24.34,7.55 23.58,7.55 CN2.1 23.58,7.81 20.28,11.11 20.28,12.63 21.29,13.65 C3.1 | C1.1 57.36,10.86 55.08,10.86 C2.1 54.82,10.6 v53.3,9.08 | 46.19,15.94 46.19,4.51 REGULATOR.1 | 46.19,15.94 46.19,19.24 43.14,19.24 U$4.GND 42.88,19.24 v41.61,19.24 | 46.19,15.94 53.55,15.94 53.81,16.19 53.81,19.75 52.79,19.75 U$5.S2_S3 | R7.1 30.18,81.47 27.64,78.93 27.64,70.29 R11.1 27.64,70.04 27.64,67.24 R12.1 27.39,66.99 26.37,65.97 26.37,64.96 25.61,64.2 R8.1 25.61,63.94 26.12,63.43 26.12,58.61 IC1.8 28.15,58.61 28.15,48.45 | v43.39,80.2 44.66,81.47 R5.1 | R6.1 37.8,81.47 38.57,80.71 v38.57,80.2 36.79,78.42 36.79,54.54 36.53,54.29 v36.53,47.94 | SV1.2 50.25,56.58 48.22,56.58 48.22,50.23 46.19,48.19 U$3.GND | 28.15,48.45 29.42,48.45 29.42,44.64 30.95,43.11 U$3.GND1 | 28.15,48.45 22.56,48.45 21.8,47.69 21.8,45.91 23.07,44.64 LEFT_HEADER.3 | v39.58,40.83 v39.58,19.49
  Bottom 0.508: v53.3,9.08 50,5.78 47.71,5.78 46.44,4.51 REGULATOR.1 46.19,4.51 41.87,8.82 24.85,8.82 23.58,7.55 CN2.1 | v43.39,80.2 v38.57,80.2 | RIGHT_HEADER.3 54.06,44.64 55.33,45.91 55.33,48.45 46.44,48.45 46.19,48.19 U$3.GND 46.19,47.94 v36.53,47.94 35.77,47.94 30.95,43.11 U$3.GND1 30.95,42.86 37.55,42.86 v39.58,40.83 | v41.61,19.24 41.36,19.49 v39.58,19.49
  pour Top: 16.98,34.73 16.98,-0.83 61.05,-0.83 61.05,34.86 42.38,34.86 42.38,43.62 34.76,43.62 34.76,34.73
IR_DIAG  (via drill 0.61)
  Top 0.254: IC1.5 26.37,56.83 26.37,57.34 IC1.6 26.12,57.34 24.6,57.34 v24.6,59.37
  Bottom 0.254: v24.6,59.37 29.68,64.45 45.17,64.45 46.19,63.43 U$3.D7
IR_FRONT  (via drill 0.61)
  Top 0.254: 26.37,54.04 26.37,54.54 IC1.2 | 26.37,54.04 27.14,53.27 v27.14,53.02 | 26.37,54.04 IC1.1
  Bottom 0.254: v27.14,53.02 28.41,54.29 36.79,54.29 40.6,58.1 46.19,58.1 U$3.D5
IR_SIDE  (via drill 0.61)
  Top 0.254: IC1.3 26.37,55.31 26.37,56.07 IC1.4 26.12,56.07 v24.85,56.07
  Bottom 0.254: v24.85,56.07 25.61,56.83 38.57,56.83 42.12,60.39 45.93,60.39 46.19,60.64 U$3.D6
L_ENC_A
  Bottom 0.254: U$3.D8 46.19,65.72 48.73,63.18 51.27,63.18 52.28,62.16 52.28,58.1 47.96,58.1 46.69,56.83 41.87,56.83 34.25,49.21 25.36,49.21 23.33,47.18 LEFT_HEADER.1
L_ENC_B  (via drill 0.61)
  Top 0.254: v52.79,65.47 52.79,69.28 46.19,75.88 U$3.D12
  Bottom 0.254: v52.79,65.47 52.79,51.75 38.31,51.75 33.23,46.67 26.12,46.67 25.87,46.92 LEFT_HEADER.2
L_PWM_A  (via drill 0.61)
  Top 0.254: v35.52,65.47 35.52,41.08 36.03,40.57 36.03,23.3 35.01,23.3 32.47,20.76 29.68,20.76 U$1.INA
  Bottom 0.254: v35.52,65.47 40.85,70.8 46.19,70.8 U$3.D10
L_PWM_B  (via drill 0.61)
  Top 0.254: v29.93,16.19 29.93,17.71 29.68,17.97 U$1.INB | v36.53,16.7 38.06,18.22 38.06,43.11 39.07,44.13 39.07,54.54 42.88,58.35 42.88,70.04 46.19,73.34 U$3.D11
  Bottom 0.254: v29.93,16.19 30.44,16.7 v36.53,16.7
N$1  (via drill 0.61)
  Top 0.254: v32.72,17.97 35.01,17.97 U$1.OUTB | 20.79,17.21 v22.31,17.21 | 20.79,17.21 20.79,16.95 U$2.G1 20.79,17.21 | 20.79,17.21 20.79,18.48 U$2.G2
  Bottom 0.254: v32.72,17.97 31.96,17.21 v22.31,17.21
N$2  (via drill 0.61)
  Top 0.254: v19.26,21.52 19.26,20.76 21.8,20.76 21.8,20.25 26.12,20.25 U$2.D3_D4
  Bottom 0.254: v19.26,21.52 19.26,23.05 35.01,23.05 36.03,24.06 36.03,39.05 26.63,39.05 23.83,41.84 23.33,41.84 LEFT_HEADER.5
N$3
  Top 0.254: U$1.OUTA 35.01,20.51 32.98,20.51 32.98,19.75 31.71,18.48 31.71,12.13 23.83,4.25 18.75,4.25 18.75,20.76 18.25,21.27 18.25,21.78 19.01,22.54 20.53,22.54 20.53,21.78 U$2.G3 20.79,21.52 26.12,21.52 U$2.G4
N$4  (via drill 0.61)
  Top 0.254: v24.85,18.22 26.12,16.95 U$2.D1_D2 | v36.53,41.34 v36.53,22.03
  Bottom 0.254: v24.85,18.22 28.66,22.03 v36.53,22.03 | v36.53,41.34 36.28,41.59 26.12,41.59 25.87,41.84 LEFT_HEADER.6
N$5
  Bottom 0.508: CN2.2 23.58,5.52 25.61,7.55 29.17,7.55 CN1.1
N$6
  Bottom 0.508: S1.P 37.04,4.51 30.44,4.51 29.42,5.52 CN1.2
N$7
  Top 0.254: 52.54,18.22 48.73,18.22 U$4.OUTB | 52.54,18.22 52.54,16.95 U$5.G1 | 52.54,18.22 U$5.G2
N$8
  Top 0.254: U$4.OUTA 48.73,20.76 52.54,20.76 52.54,21.27 U$5.G3 52.79,21.52 58.12,21.52 U$5.G4
N$9  (via drill 0.61)
  Top 0.254: v54.82,16.7 54.82,19.75 58.12,19.75 U$5.D3_D4 | v51.77,37.78 55.33,41.34 55.33,45.65 54.06,46.92 RIGHT_HEADER.5
  Bottom 0.254: v54.82,16.7 52.79,14.67 21.29,14.67 20.53,15.43 20.53,22.54 35.26,22.54 40.34,27.62 40.34,37.78 v51.77,37.78
N$10  (via drill 0.61)
  Top 0.254: v37.55,43.88 37.55,18.98 34.76,16.19 34.76,1.71 41.61,1.71 42.38,2.47 42.38,3.24 51.77,3.24 58.63,10.09 58.63,16.44 58.38,16.7 U$5.D1_D2
  Bottom 0.254: v37.55,43.88 37.8,44.13 48.47,44.13 51.27,46.92 RIGHT_HEADER.6
N$11
  Top 0.254: IC1.16 21.04,54.04 21.04,42.1 24.09,39.05 34.5,39.05 34.5,84.52 37.8,87.82 39.84,87.82 39.84,88.83 R1.1
N$12  (via drill 0.61)
  Top 0.254: v18.5,59.62 18.5,54.8 20.79,54.8 IC1.15 | v16.47,65.72 17.48,66.74 17.48,66.99 R2.1
  Bottom 0.254: v18.5,59.62 14.94,63.18 14.94,65.72 v16.47,65.72
N$13
  Top 0.254: IC1.14 20.79,55.31 19.52,55.31 19.52,61.15 R3.1
N$14  (via drill 0.61)
  Top 0.254: v23.58,60.13 23.58,56.07 21.04,56.07 IC1.13 | v35.52,66.99 36.03,67.5 36.03,84.01 38.06,86.04 R4.1
  Bottom 0.254: v23.58,60.13 30.44,66.99 v35.52,66.99
N$15
  Top 0.254: LED5.K 32.22,89.09 38.06,89.09 R1.2
N$16  (via drill 0.61)
  Top 0.254: v18.5,65.72 18.5,66.23 19.26,66.99 R2.2
  Bottom 0.254: v18.5,65.72 30.18,77.4 30.18,82.99 42.38,82.99 LED6.K
N$17
  Top 0.254: R3.2 17.48,61.4 10.88,61.4 10.88,65.47 9.86,66.48 LED7.K
N$18  (via drill 0.61)
  Top 0.254: v41.36,69.78 41.36,85.02 40.34,86.04 R4.2
  Bottom 0.254: v41.36,69.78 44.15,66.99 67.27,66.99 LED8.K
N$19  (via drill 0.61)
  Top 0.254: v22.56,62.67 22.56,56.58 21.04,56.58 IC1.12 | v18.5,62.67 17.74,63.43 17.74,63.94 R9.1
  Bottom 0.254: v18.5,62.67 v22.56,62.67
N$20
  Top 0.254: IC1.11 21.04,57.34 22.06,57.34 22.06,61.91 21.55,62.42 21.55,68.01 19.52,70.04 R10.1
N$21  (via drill 0.61)
  Top 0.254: v20.53,65.72 20.53,65.21 19.52,64.2 R9.2
  Bottom 0.254: v20.53,65.72 29.42,74.61 61.68,74.61 63.71,76.64 LED1.K
N$22
  Top 0.254: R10.2 17.48,70.29 16.72,71.05 16.72,78.42 LED2.K
R_ENC_A
  Bottom 0.254: U$3.D2 46.19,50.48 47.46,49.21 55.58,49.21 56.09,48.7 56.09,42.1 54.06,42.1 RIGHT_HEADER.1
R_ENC_B
  Top 0.254: U$3.D4 46.19,55.56 44.92,54.29 44.92,42.35 45.68,41.59 51.27,41.59 51.27,41.84 RIGHT_HEADER.2
R_PWM_A  (via drill 0.61)
  Top 0.254: v59.65,19.49 59.65,22.54 47.71,22.54 46.44,21.27 46.44,20.76 43.14,20.76 U$4.INA | v39.58,13.65 38.57,14.67 38.57,42.86 39.58,43.88 39.58,50.73 45.68,56.83 47.46,56.83 47.46,54.54 46.19,53.27 U$3.D3
  Bottom 0.254: v59.65,19.49 53.81,13.65 v39.58,13.65
R_PWM_B  (via drill 0.61)
  Top 0.254: v45.17,17.97 43.14,17.97 U$4.INB | v56.6,60.39 48.73,68.26 46.19,68.26 U$3.D9
  Bottom 0.254: v45.17,17.97 45.42,17.71 56.6,17.71 57.36,18.48 57.36,23.05 42.63,23.05 41.87,23.81 41.87,36 52.54,36 56.6,40.07 v56.6,60.39
SCL
  Bottom 0.254: SV1.4 50.25,61.91 45.17,61.91 43.9,63.18 30.95,63.18 U$3.A5
SDA  (via drill 0.61)
  Top 0.254: v43.9,61.91 43.9,64.45 50.25,64.45 SV1.5
  Bottom 0.254: v43.9,61.91 42.88,60.89 30.95,60.89 U$3.A4
SIDE_L_IN  (via drill 0.61)
  Top 0.254: R8.2 27.64,63.94 29.68,61.91 29.68,59.62 30.95,58.35 U$3.A3 | v15.96,63.94 15.45,64.45 15.45,66.23 11.9,69.78 T4.E
  Bottom 0.254: v15.96,63.94 21.55,58.35 30.95,58.35 U$3.A3
SIDE_R_IN  (via drill 0.61)
  Top 0.254: R7.2 32.22,81.47 v32.22,72.07 32.22,57.08 30.95,55.81 U$3.A2
  Bottom 0.254: T1.E 65.74,72.07 v32.22,72.07
V_ARDU  (via drill 0.61)
  Top 0.508: v41.61,39.81 41.36,39.56 41.36,20.51 40.6,19.75 40.6,7.55 S1.S
  Bottom 0.508: S1.S 37.55,1.46 45.68,1.46 48.47,4.25 REGULATOR.2 | v41.61,39.81 31.45,39.81 30.95,40.32 U$3.VIN

### Text on the board
tPlace: REV 1.0.0 | ON | OFF